# EAGLE schematic openDrive_MC_00.23 (EAGLE 5.10)
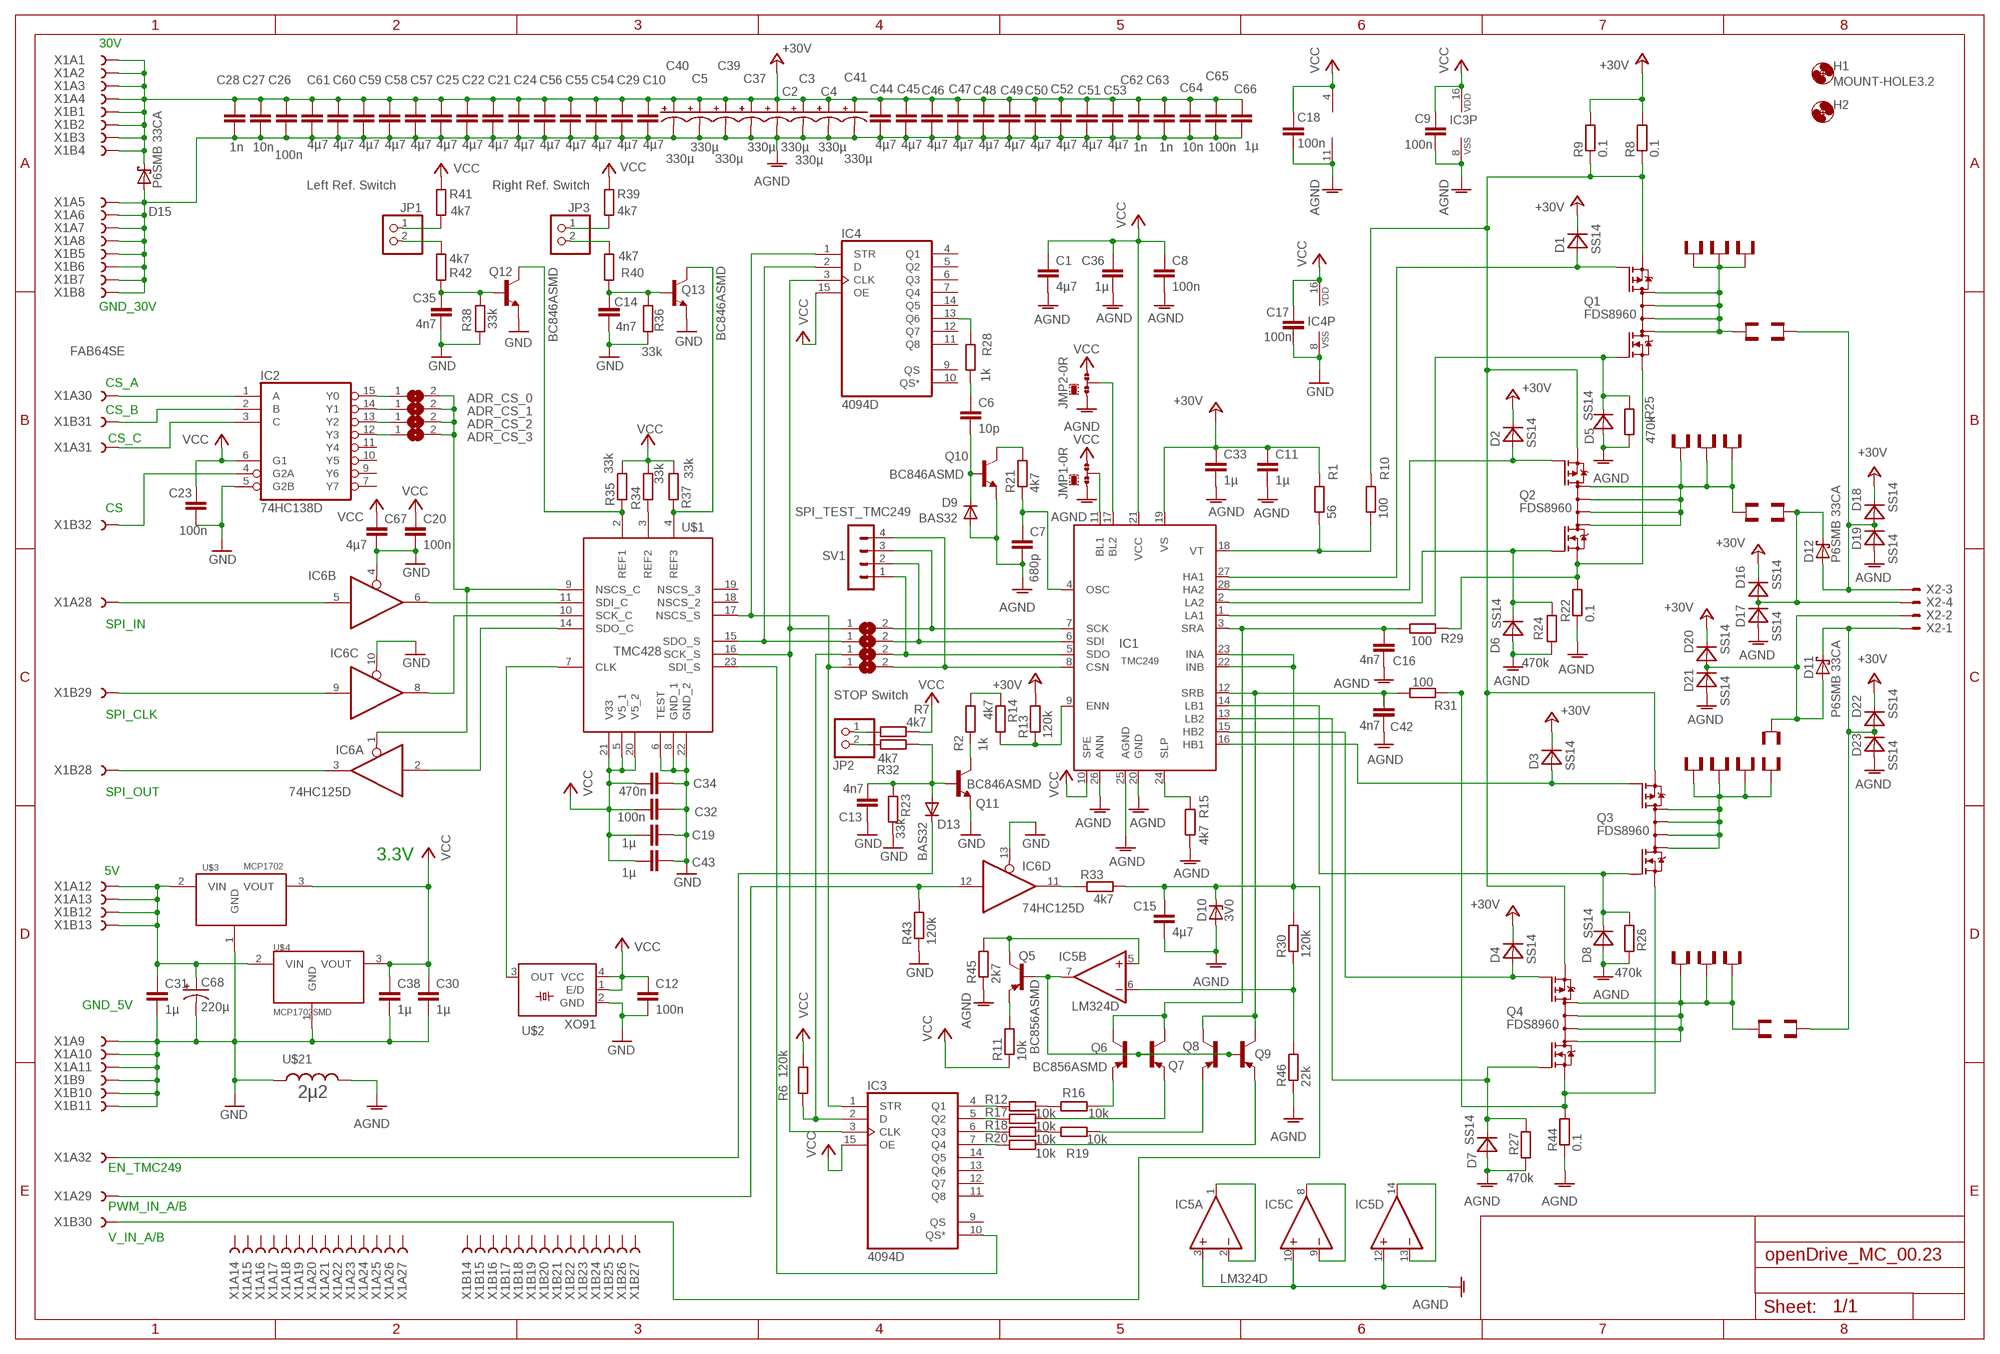
[diagram p0: schematic, sheet 1]

## Parts
C1  4µ7  C-EUC1206  [C1206]
C2  330µ  CAP_POLG  [PANASONIC_G]
C3  330µ  CAP_POLG  [PANASONIC_G]
C4  330µ  CAP_POLG  [PANASONIC_G]
C5  330µ  CAP_POLG  [PANASONIC_G]
C6  10p  C-EUC1206  [C1206]
C7  680p  C-EUC1206  [C1206]
C8  100n  C-EUC1206  [C1206]
C9  100n  C-EUC1206  [C1206]
C10  4µ7  C-EUC1206  [C1206]
C11  1µ  C-EUC1206  [C1206]
C12  100n  C-EUC1206  [C1206]
C13  4n7  C-EUC1206  [C1206]
C14  4n7  C-EUC1206  [C1206]
C15  4µ7  C-EUC1206  [C1206]
C16  4n7  C-EUC1206  [C1206]
C17  100n  C-EUC1206  [C1206]
C18  100n  C-EUC1206  [C1206]
C19  1µ  C-EUC1206  [C1206]
C20  100n  C-EUC1206  [C1206]
C21  4µ7  C-EUC1206  [C1206]
C22  4µ7  C-EUC1206  [C1206]
C23  100n  C-EUC1206  [C1206]
C24  4µ7  C-EUC1206  [C1206]
C25  4µ7  C-EUC1206  [C1206]
C26  100n  C-EUC1206  [C1206]
C27  10n  C-EUC1206  [C1206]
C28  1n  C-EUC1206  [C1206]
C29  4µ7  C-EUC1206  [C1206]
C30  1µ  C-EUC1206  [C1206]
C31  1µ  C-EUC1206  [C1206]
C32  100n  C-EUC1206  [C1206]
C33  1µ  C-EUC1206  [C1206]
C34  470n  C-EUC1206  [C1206]
C35  4n7  C-EUC1206  [C1206]
C36  1µ  C-EUC1206  [C1206]
C37  330µ  CAP_POLG  [PANASONIC_G]
C38  1µ  C-EUC1206  [C1206]
C39  330µ  CAP_POLG  [PANASONIC_G]
C40  330µ  CAP_POLG  [PANASONIC_G]
C41  330µ  CAP_POLG  [PANASONIC_G]
C42  4n7  C-EUC1206  [C1206]
C43  1µ  C-EUC1206  [C1206]
C44  4µ7  C-EUC1206  [C1206]
C45  4µ7  C-EUC1206  [C1206]
C46  4µ7  C-EUC1206  [C1206]
C47  4µ7  C-EUC1206  [C1206]
C48  4µ7  C-EUC1206  [C1206]
C49  4µ7  C-EUC1206  [C1206]
C50  4µ7  C-EUC1206  [C1206]
C51  4µ7  C-EUC1206  [C1206]
C52  4µ7  C-EUC1206  [C1206]
C53  4µ7  C-EUC1206  [C1206]
C54  4µ7  C-EUC1206  [C1206]
C55  4µ7  C-EUC1206  [C1206]
C56  4µ7  C-EUC1206  [C1206]
C57  4µ7  C-EUC1206  [C1206]
C58  4µ7  C-EUC1206  [C1206]
C59  4µ7  C-EUC1206  [C1206]
C60  4µ7  C-EUC1206  [C1206]
C61  4µ7  C-EUC1206  [C1206]
C62  1n  C-EUC1206  [C1206]
C63  1n  C-EUC1206  [C1206]
C64  10n  C-EUC1206  [C1206]
C65  100n  C-EUC1206  [C1206]
C66  1µ  C-EUC1206  [C1206]
C67  4µ7  C-EUC1206  [C1206]
C68  220µ  CAP_POLE  [PANASONIC_E]
D1  SS14  MBRA340T3  [SMA]
D2  SS14  MBRA340T3  [SMA]
D3  SS14  MBRA340T3  [SMA]
D4  SS14  MBRA340T3  [SMA]
D5  SS14  MBRA340T3  [SMA]
D6  SS14  MBRA340T3  [SMA]
D7  SS14  MBRA340T3  [SMA]
D8  SS14  MBRA340T3  [SMA]
D9  BAS32  DIODE-SOD80C  [SOD80C]
D10  3V0  ZENER-DIODESOD80C  [SOD80C]
D11  P6SMB 33CA  MBRS130LT3  [SMB]
D12  P6SMB 33CA  MBRS130LT3  [SMB]
D13  BAS32  DIODE-SOD80C  [SOD80C]
D15  P6SMB 33CA  MBRS130LT3  [SMB]
D16  SS14  MBRA340T3  [SMA]
D17  SS14  MBRA340T3  [SMA]
D18  SS14  MBRA340T3  [SMA]
D19  SS14  MBRA340T3  [SMA]
D20  SS14  MBRA340T3  [SMA]
D21  SS14  MBRA340T3  [SMA]
D22  SS14  MBRA340T3  [SMA]
D23  SS14  MBRA340T3  [SMA]
H1  MOUNT-HOLE3.2  [3,2]
H2  MOUNT-HOLE3.2  [3,2]
IC1  TMC249  TMC239  [SO28W]
IC2  74HC138D  [SO16]
IC3  4094D  [SO16]
IC4  4094D  [SO16]
IC5  LM324D  [SO14]
IC6  74HC125D  [SO14]
JMP1  0R-JUMPB  [B0R-JMP]
JMP2  0R-JUMPB  [B0R-JMP]
JP1  Left Ref. Switch  PINHD-1X2  [1X02]
JP2  STOP Switch  PINHD-1X2  [1X02]
JP3  Right Ref. Switch  PINHD-1X2  [1X02]
Q1  FDS8960  IRF7389  [SO08-IRF]
Q2  FDS8960  IRF7389  [SO08-IRF]
Q3  FDS8960  IRF7389  [SO08-IRF]
Q4  FDS8960  IRF7389  [SO08-IRF]
Q5  BC856ASMD  [SOT23-BEC]
Q6  BC856ASMD  [SOT23-BEC]
Q7  BC856ASMD  [SOT23-BEC]
Q8  BC856ASMD  [SOT23-BEC]
Q9  BC856ASMD  [SOT23-BEC]
Q10  BC846ASMD  [SOT23]
Q11  BC846ASMD  [SOT23]
Q12  BC846ASMD  [SOT23]
Q13  BC846ASMD  [SOT23]
R1  56  R-EU_M1206  [M1206]
R2  1k  R-EU_M1206  [M1206]
R6  120k  R-EU_M1206  [M1206]
R7  4k7  R-EU_M1206  [M1206]
R8  0.1  R-EU_R2512  [R2512]
R9  0.1  R-EU_R2512  [R2512]
R10  100  R-EU_M1206  [M1206]
R11  10k  R-EU_M1206  [M1206]
R12  10k  R-EU_M1206  [M1206]
R13  120k  R-EU_M1206  [M1206]
R14  4k7  R-EU_M1206  [M1206]
R15  4k7  R-EU_M1206  [M1206]
R16  10k  R-EU_M1206  [M1206]
R17  10k  R-EU_M1206  [M1206]
R18  10k  R-EU_M1206  [M1206]
R19  10k  R-EU_M1206  [M1206]
R20  10k  R-EU_M1206  [M1206]
R21  4k7  R-EU_M1206  [M1206]
R22  0.1  R-EU_R2512  [R2512]
R23  33k  R-EU_M1206  [M1206]
R24  470k  R-EU_M1206  [M1206]
R25  470k  R-EU_M1206  [M1206]
R26  470k  R-EU_M1206  [M1206]
R27  470k  R-EU_M1206  [M1206]
R28  1k  R-EU_M1206  [M1206]
R29  100  R-EU_M1206  [M1206]
R30  120k  R-EU_M1206  [M1206]
R31  100  R-EU_M1206  [M1206]
R32  4k7  R-EU_M1206  [M1206]
R33  4k7  R-EU_M1206  [M1206]
R34  33k  R-EU_M1206  [M1206]
R35  33k  R-EU_M1206  [M1206]
R36  33k  R-EU_M1206  [M1206]
R37  33k  R-EU_M1206  [M1206]
R38  33k  R-EU_M1206  [M1206]
R39  4k7  R-EU_M1206  [M1206]
R40  4k7  R-EU_M1206  [M1206]
R41  4k7  R-EU_M1206  [M1206]
R42  4k7  R-EU_M1206  [M1206]
R43  120k  R-EU_M1206  [M1206]
R44  0.1  R-EU_R2512  [R2512]
R45  2k7  R-EU_M1206  [M1206]
R46  22k  R-EU_M1206  [M1206]
SJ1  ADR_CS_0  SJ  [SJ]
SJ2  ADR_CS_1  SJ  [SJ]
SJ3  ADR_CS_2  SJ  [SJ]
SJ4  ADR_CS_3  SJ  [SJ]
SJ5  SJ  [SJ]
SJ6  SJ  [SJ]
SJ7  SJ  [SJ]
SJ8  SJ  [SJ]
SV1  SPI_TEST_TMC249  MA04-1  [MA04-1]
U$1  TMC428  [SOP24]
U$2  XO91  [XO91]
U$3  MCP1702  [TO92]
U$4  MCP1702SMD  [SOT89]
U$5  PIN1  [PAD]
U$6  PIN1  [PAD]
U$7  PIN1  [PAD]
U$8  PIN1  [PAD]
U$9  PIN1  [PAD]
U$10  PIN1  [PAD]
U$11  PIN1  [PAD]
U$12  PIN1  [PAD]
U$13  PIN1  [PAD]
U$14  PIN1  [PAD]
U$15  PIN1  [PAD]
U$16  PIN1  [PAD]
U$17  PIN1  [PAD]
U$18  PIN1  [PAD]
U$19  PIN1  [PAD]
U$20  PIN1  [PAD]
U$21  2µ2  INDUCTOR1210  [1210]
U$22  PIN1  [PAD]
U$23  PIN1  [PAD]
U$24  PIN1  [PAD]
U$25  PIN1  [PAD]
X1  FAB64SE  [FAB64S]
X2  AKL18X-04W  [AKL182-04]

## Nets
+30V: C2.+ C3.+ C4.+ C5.+ C10.1 C11.1 C21.1 C22.1 C24.1 C25.1 C26.1 C27.1 C28.1 C29.1 C33.1 C37.+ C39.+ C40.+ C41.+ C44.1 C45.1 C46.1 C47.1 C48.1 C49.1 C50.1 C51.1 C52.1 C53.1 C54.1 C55.1 C56.1 C57.1 C58.1 C59.1 C60.1 C61.1 C62.1 C63.1 C64.1 C65.1 C66.1 D1.C D2.C D3.C D4.C D15.C D16.C D18.C D20.C D22.C IC1.19(VS) R1.2 R8.2 R9.2 R13.2 X1.A1 X1.A2 X1.A3 X1.A4 X1.B1 X1.B2 X1.B3 X1.B4
AGND: C1.2 C2.- C3.- C4.- C5.- C7.2 C8.2 C9.2 C10.2 C11.2 C15.2 C16.2 C18.2 C21.2 C22.2 C24.2 C25.2 C26.2 C27.2 C28.2 C29.2 C33.2 C36.2 C37.- C39.- C40.- C41.- C42.2 C44.2 C45.2 C46.2 C47.2 C48.2 C49.2 C50.2 C51.2 C52.2 C53.2 C54.2 C55.2 C56.2 C57.2 C58.2 C59.2 C60.2 C61.2 C62.2 C63.2 C64.2 C65.2 C66.2 D5.A D6.A D7.A D8.A D9.A D10.A D15.A D17.A D19.A D21.A D23.A IC1.20(GND) IC1.25(AGND) IC1.26(ANN) IC3.8(VSS) IC5.3(A:+IN) IC5.10(C:+IN) IC5.11(P:V-) IC5.12(D:+IN) JMP1.3 JMP2.3 Q10.2(E) R15.1 R22.1 R24.1 R25.1 R26.1 R27.1 R44.1 R45.1 R46.1 U$21.2 X1.A5 X1.A6 X1.A7 X1.A8 X1.B5 X1.B6 X1.B7 X1.B8
GND: C12.2 C13.2 C14.2 C17.2 C19.2 C20.2 C23.2 C30.2 C31.2 C32.2 C34.2 C35.2 C38.2 C43.2 C67.2 C68.- IC2.5(G2B) IC4.8(VSS) IC6.4(B:OE) IC6.10(C:OE) IC6.13(D:OE) Q11.2(E) Q12.2(E) Q13.2(E) R23.1 R36.1 R38.1 R43.1 U$1.6(TEST) U$1.8(GND_1) U$1.22(GND_2) U$2.2(GND) U$3.1(GND) U$4.1(GND) U$21.1 X1.A9 X1.A10 X1.A11 X1.B9 X1.B10 X1.B11
N$1: D4.A IC1.15(HB2) Q4.4(P-G)
N$2: U$1.7(CLK) U$2.3(OUT)
N$3: D3.A IC1.16(HB1) Q3.4(P-G)
N$4: IC6.5(B:I) X1.A28
N$5: Q4.5(D) Q4.6(D) Q4.7(D) Q4.8(D) U$17.1 U$18.1 U$19.1 U$20.1
N$6: Q1.1(N-S) Q2.1(N-S) R22.2 R29.2
N$7: Q3.5(D) Q3.6(D) Q3.7(D) Q3.8(D) U$13.1 U$14.1 U$15.1 U$16.1
N$8: D2.A IC1.28(HA2) Q2.4(P-G)
N$9: Q2.5(D) Q2.6(D) Q2.7(D) Q2.8(D) U$9.1 U$10.1 U$11.1 U$12.1
N$10: D5.C IC1.1(LA1) Q1.2(N-G) R25.2
N$11: D1.A IC1.27(HA1) Q1.4(P-G)
N$12: Q1.5(D) Q1.6(D) Q1.7(D) Q1.8(D) U$5.1 U$6.1 U$7.1 U$8.1
N$13: D6.C IC1.2(LA2) Q2.2(N-G) R24.2
N$14: C7.1 IC1.4(OSC) R21.1
N$15: D7.C IC1.13(LB2) Q4.2(N-G) R27.2
N$16: C15.1 D10.C IC1.22(INB) IC1.23(INA) R30.2 R33.2 X1.B30
N$17: IC1.18(VT) R1.1 R10.1
N$18: IC5.6(B:-IN) R30.1 R46.2
N$19: IC1.7(SCK) SJ5.2 SV1.3
N$20: C16.1 IC1.3(SRA) Q6.C Q7.C R29.1
N$21: Q6.E R16.2
N$22: C42.1 IC1.12(SRB) Q8.C Q9.C R31.1
N$23: Q7.E R17.2
N$24: IC1.11(BL1) JMP1.2
N$25: IC5.7(B:OUT) Q5.B Q6.B Q7.B Q8.B Q9.B
N$26: Q8.E R19.2
N$27: Q9.E R20.2
N$28: IC1.24(SLP) R15.2
N$29: R12.2 R16.1
N$30: R18.2 R19.1
N$31: IC3.4(Q1) R12.1
N$32: IC3.5(Q2) R17.1
N$33: IC3.6(Q3) R18.1
N$34: IC3.7(Q4) R20.1
N$35: IC4.2(D) SJ6.1 U$1.15(SDO_S)
N$36: IC3.3(CLK) IC4.3(CLK) SJ5.1 U$1.16(SCK_S)
N$37: IC3.1(STR) IC4.1(STR) SJ8.1 U$1.17(NSCS_S)
N$38: IC3.10(QS*) U$1.23(SDI_S)
N$39: IC3.2(D) R6.1 SJ7.1
N$40: IC1.17(BL2) JMP2.2
N$41: IC6.9(C:I) X1.B29
N$42: Q1.3(P-S) Q2.3(P-S) Q3.3(P-S) Q4.3(P-S) R8.1 R9.1 R10.2
N$43: JP2.1 R7.1
N$44: JP2.2 R32.2
N$45: D8.C IC1.14(LB1) Q3.2(N-G) R26.2
N$46: IC6.2(A:I) U$1.14(SDO_C)
N$47: Q10.3(C) R21.2
N$48: R2.2 R14.1
N$49: C6.2 D9.C Q10.1(B)
N$50: IC5.1(A:OUT) IC5.2(A:-IN)
N$51: IC4.13(Q6) R28.2
N$52: C6.1 R28.1
N$53: IC5.8(C:OUT) IC5.9(C:-IN)
N$54: IC5.13(D:-IN) IC5.14(D:OUT)
N$55: IC6.11(D:O) R33.1
N$56: IC1.9(ENN) R13.1 R14.2
N$57: IC5.5(B:+IN) Q5.C R45.2
N$58: IC6.8(C:O) U$1.10(SCK_C)
N$59: Q5.E R11.2
N$60: IC6.6(B:O) U$1.11(SDI_C)
N$61: IC6.1(A:OE) SJ1.2 SJ2.2 SJ3.2 SJ4.2 U$1.9(NSCS_C)
N$62: IC2.15(Y0) SJ1.1
N$63: IC2.14(Y1) SJ2.1
N$64: IC2.13(Y2) SJ3.1
N$65: IC2.12(Y3) SJ4.1
N$66: IC2.2(B) X1.B31
N$67: IC2.4(G2A) X1.B32
N$68: IC2.3(C) X1.A31
N$69: IC2.1(A) X1.A30
N$70: D12.C D16.A D17.C U$22.1 X2.P$4
N$71: Q11.3(C) R2.1
N$72: IC6.3(A:O) X1.B28
N$73: IC6.12(D:I) R43.2 X1.A29
N$74: C13.1 D13.A Q11.1(B) R23.2 R32.1
N$75: C31.1 C68.+ U$3.2(VIN) U$4.2(VIN) X1.A12 X1.A13 X1.B12 X1.B13
N$76: D13.C X1.A32
N$77: Q12.3(C) R35.1 U$1.2(REF1)
N$78: R34.1 U$1.3(REF2)
N$79: Q13.3(C) R37.1 U$1.4(REF3)
N$80: D11.C D22.A D23.C U$24.1 X2.P$1
N$82: C35.1 Q12.1(B) R38.2 R42.1
N$83: JP1.2 R42.2
N$84: JP1.1 R41.1
N$85: C14.1 Q13.1(B) R36.2 R40.1
N$86: JP3.2 R40.2
N$87: JP3.1 R39.1
N$88: IC1.6(SDI) SJ6.2 SV1.2
N$89: IC1.5(SDO) SJ7.2 SV1.1
N$90: IC1.8(CSN) SJ8.2 SV1.4
N$91: Q3.1(N-S) Q4.1(N-S) R31.2 R44.2
N$94: D12.A D18.A D19.C U$25.1 X2.P$3
N$95: D11.A D20.A D21.C U$23.1 X2.P$2
VCC: C1.1 C8.1 C9.1 C12.1 C17.1 C18.1 C19.1 C20.1 C23.1 C30.1 C32.1 C34.1 C36.1 C38.1 C43.1 C67.1 IC1.10(SPE) IC1.21(VCC) IC2.6(G1) IC3.15(OE) IC3.16(VDD) IC4.15(OE) IC4.16(VDD) IC5.4(P:V+) JMP1.1 JMP2.1 R6.2 R7.2 R11.1 R34.2 R35.2 R37.2 R39.2 R41.2 U$1.5(V5_1) U$1.20(V5_2) U$1.21(V33) U$2.1(E/D) U$2.4(VCC) U$3.3(VOUT) U$4.3(VOUT)
Unconnected: IC2.7(Y7) IC2.9(Y6) IC2.10(Y5) IC2.11(Y4) IC3.9(QS) IC3.11(Q8) IC3.12(Q7) IC3.13(Q6) IC3.14(Q5) IC4.4(Q1) IC4.5(Q2) IC4.6(Q3) IC4.7(Q4) IC4.9(QS) IC4.10(QS*) IC4.11(Q8) IC4.12(Q7) IC4.14(Q5) U$1.18(NSCS_2) U$1.19(NSCS_3) X1.A14 X1.A15 X1.A16 X1.A17 X1.A18 X1.A19 X1.A20 X1.A21 X1.A22 X1.A23 X1.A24 X1.A25 X1.A26 X1.A27 X1.B14 X1.B15 X1.B16 X1.B17 X1.B18 X1.B19 X1.B20 X1.B21 X1.B22 X1.B23 X1.B24 X1.B25 X1.B26 X1.B27

## Notes on the sheet
- 30V
- GND_30V
- CS_A
- CS_B
- CS_C
- CS
- SPI_IN
- SPI_CLK
- SPI_OUT
- 3.3V
- 5V
- GND_5V
- EN_TMC249
- PWM_IN_A/B
- V_IN_A/B

## Power pins joined to a net without a drawn wire
GND: IC2.8(GND) IC6.7(P:GND)
VCC: IC2.16(VCC) IC6.14(P:VCC)

## Library data of the parts
C1 C6-C36 C38 C42-C67 = rcl:C-EU: CAPACITOR, European symbol
C2-C5 C37 C39-C41 C68 = SparkFun:CAP_POL: Capacitor Polarized These are standard SMD and PTH capacitors. Normally 10uF, 47uF, and 100uF in electrolytic and tantalum varieties. Always verify the external diameter of the through hole cap, it varies with capacity, voltage, and manufacturer. The EIA devices should be standard.
D1-D8 D16-D23 = diode:MBRA340T3: Surface Mount Schottky Power Rectifier Source: http://www.onsemi.com/pub_link/Collateral/MBRA340T3-D.PDF
D9 D13 = diode:DIODE-: DIODE
D10 = diode:ZENER-DIODE: Z-Diode
D11 D12 D15 = diode:MBRS130LT3: Schottky Power Rectifier Source: http://www.onsemi.com/pub/Collateral/MBRS130LT3-D.PDF
H1 H2 = holes:MOUNT-HOLE: MOUNTING HOLE with drill center marker
IC1 = tmc:TMC239: TMC239 Stepper Motor Driver - up to 4A, w. protection and diagnostics
IC2 = 74xx-eu:74*138: 3-line to 8-line DECODER/DEMULTIPLEXER
IC3 IC4 = 40xx:4094: 8-stage SHIFT/STORE REGISTER, tri-state
IC5 = linear:LM324: OP AMP
IC6 = 74xx-eu:74*125: Quad bus BUFFER, 3-state
JMP1 JMP2 = jump-0r-smd:0R-JUMP: SMD 0R 0805 Jumper
JP1-JP3 = pinhead:PINHD-1X2: PIN HEADER
Q1-Q4 = transistor-fet:IRF7389: Complimentary Half Bridge HEXFET Power MOSFET Source: http://www.irf.com/product-info/datasheets/data/irf7389.pdf
Q5-Q9 = transistor-pnp:BC856*: PNP Transistror
Q10-Q13 = transistor-npn:BC846*: NPN Transistor
R1 R2 R6-R46 = rcl:R-EU_: RESISTOR, European symbol
SJ1-SJ8 = jumper:SJ: SMD solder JUMPER
SV1 = con-lstb:MA04-1: PIN HEADER
U$1 = tmc428:TMC428
U$2 = euroquartz:XO91
U$3 U$4 = mcp1702:MCP1702
U$5-U$20 U$22-U$25 = con-faston:PIN1
U$21 = SparkFun:INDUCTOR: Inductors Basic Inductor/Choke - 0603 and 1206. Footprints are not proven and vary greatly between part numbers.
X1 = con-vg:FAB64SE: CONNECTOR female, 64 pins, single, type B, rows AB, grid 2.54 mm
X2 = con-riacon_akl:AKL18X-04: Riacon AKL18X Steckverbinder 4-Pol Grid = 3,5mm